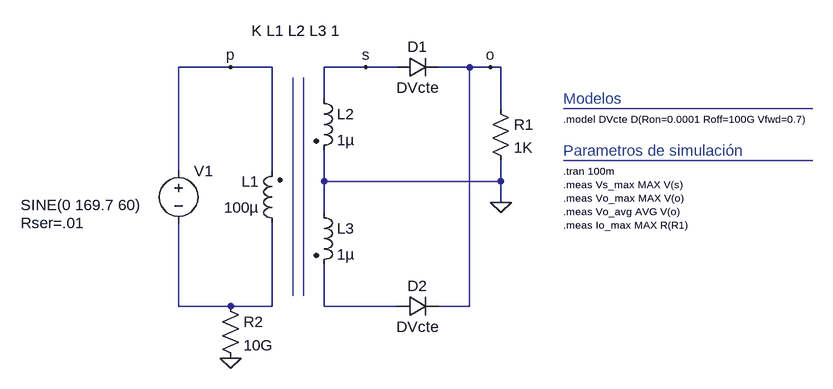
[diagram p0: schematic rectificador-onda-completa-tap_ejemplo2.asc]
rectificador-onda-completa-tap_ejemplo2.asc, the LTspice schematic file:
Version 4
SHEET 1 1304 680
WIRE 80 80 0 80
WIRE 144 80 80 80
WIRE 288 80 224 80
WIRE 336 80 288 80
WIRE 448 80 400 80
WIRE 480 80 448 80
WIRE 496 80 480 80
WIRE 224 128 224 80
WIRE 496 144 496 80
WIRE 0 240 0 80
WIRE 144 240 144 80
WIRE 224 256 224 208
WIRE 496 256 496 224
WIRE 496 256 224 256
WIRE 496 288 496 256
WIRE 224 304 224 256
WIRE 0 448 0 320
WIRE 80 448 0 448
WIRE 144 448 144 320
WIRE 144 448 80 448
WIRE 224 448 224 384
WIRE 336 448 224 448
WIRE 448 448 448 80
WIRE 448 448 400 448
FLAG 496 288 0
FLAG 80 528 0
FLAG 288 80 s
FLAG 80 80 p
FLAG 480 80 o
SYMBOL ind2 160 336 R180
WINDOW 0 36 80 Left 2
WINDOW 3 36 40 Left 2
SYMATTR InstName L1
SYMATTR Value 100µ
SYMATTR Type ind
SYMBOL ind2 208 112 R0
SYMATTR InstName L2
SYMATTR Value 1µ
SYMATTR Type ind
SYMBOL voltage 0 224 R0
WINDOW 3 -243 68 Left 2
WINDOW 123 0 0 Left 0
WINDOW 39 -243 96 Left 2
SYMATTR Value SINE(0 169.7 60)
SYMATTR SpiceLine Rser=.01
SYMATTR InstName V1
SYMBOL res 480 128 R0
SYMATTR InstName R1
SYMATTR Value 1K
SYMBOL res 64 432 R0
SYMATTR InstName R2
SYMATTR Value 10G
SYMBOL diode 336 96 R270
WINDOW 0 32 32 VTop 2
WINDOW 3 0 32 VBottom 2
SYMATTR InstName D1
SYMATTR Value DVcte
SYMBOL diode 336 464 R270
WINDOW 0 32 32 VTop 2
WINDOW 3 0 32 VBottom 2
SYMATTR InstName D2
SYMATTR Value DVcte
SYMBOL ind2 208 288 R0
SYMATTR InstName L3
SYMATTR Value 1µ
SYMATTR Type ind
TEXT 592 240 Left 1 !.tran 100m\n.meas Vs_max MAX V(s)\n.meas Vo_max MAX V(o)\n.meas Vo_avg AVG V(o)\n.meas Io_max MAX R(R1)
TEXT 112 24 Left 2 !K L1 L2 L3 1
TEXT 592 160 Left 1 !.model DVcte D(Ron=0.0001 Roff=100G Vfwd=0.7)
TEXT 592 128 Left 2 ;Modelos
TEXT 592 208 Left 2 ;Parametros de simulación
LINE Normal 192 432 192 96
LINE Normal 176 432 176 96
LINE Normal 976 144 592 144
LINE Normal 976 144 976 144 2
LINE Normal 976 224 592 224

The netlist it stands for:
* rectificador-onda-completa-tap_ejemplo2.asc
L1 N001 p 100µ
L2 s 0 1µ
V1 p N001 SINE(0 169.7 60) Rser=.01
R1 o 0 1K
R2 N001 0 10G
D1 s o DVcte
D2 N002 o DVcte
L3 0 N002 1µ
.model D D
.lib standard.dio
.tran 100m
.meas Vs_max MAX V(s)
.meas Vo_max MAX V(o)
.meas Vo_avg AVG V(o)
.meas Io_max MAX R(R1)
K L1 L2 L3 1
.model DVcte D(Ron=0.0001 Roff=100G Vfwd=0.7)
* Modelos
* Parametros de simulación
.backanno
.end